# Altium schematic sheet CW308T_K24_UFO.SchDoc: <Enter Sheet Title>
size Letter; Organization: NewAE Technology Inc.; Address1: 1083 Queen St., Suite 196; Address2: Halifax; Address3: NS; Address4: Canada B3H 0B2; SheetApproved: NO
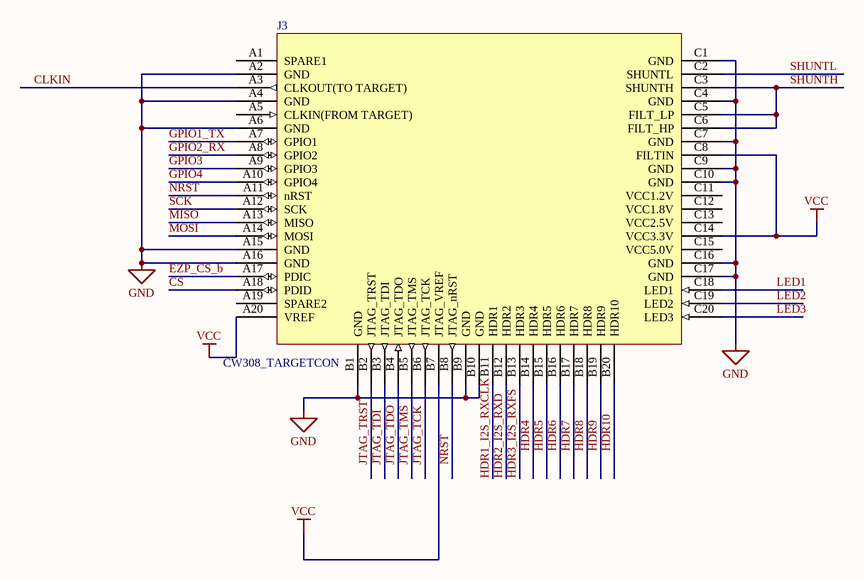
[diagram p0: CW308T_K24_UFO.SchDoc]

## Parts
J3  CW308_TARGETCON  [CW308_TBOARD_CONN]

## Nets
GND: J3.A2(GND) J3.A4(GND) J3.A6(GND) J3.A15(GND) J3.A16(GND) J3.B1(GND) J3.B9(GND) J3.B10(GND) J3.C1(GND) J3.C4(GND) J3.C7(GND) J3.C9(GND) J3.C10(GND) J3.C16(GND) J3.C17(GND)
VCC: J3.A20(VREF) J3.B7(JTAG_VREF) J3.C8(FILTIN) J3.C14(VCC3.3V)
CLKIN: J3.A3(CLKOUT(TO_TARGET))
CS: J3.A18(PDID)
EZP_CS_b: J3.A17(PDIC)
GPIO1_TX: J3.A7(GPIO1)
GPIO2_RX: J3.A8(GPIO2)
GPIO3: J3.A9(GPIO3)
GPIO4: J3.A10(GPIO4)
HDR1_I2S_RXCLK: J3.B11(HDR1)
HDR2_I2S_RXD: J3.B12(HDR2)
HDR3_I2S_RXFS: J3.B13(HDR3)
HDR4: J3.B14(HDR4)
HDR5: J3.B15(HDR5)
HDR6: J3.B16(HDR6)
HDR7: J3.B17(HDR7)
HDR8: J3.B18(HDR8)
HDR9: J3.B19(HDR9)
HDR10: J3.B20(HDR10)
JTAG_TCK: J3.B6(JTAG_TCK)
JTAG_TDI: J3.B3(JTAG_TDI)
JTAG_TDO: J3.B4(JTAG_TDO)
JTAG_TMS: J3.B5(JTAG_TMS)
JTAG_TRST: J3.B2(JTAG_TRST)
LED1: J3.C18(LED1)
LED2: J3.C19(LED2)
LED3: J3.C20(LED3)
MISO: J3.A13(MISO)
MOSI: J3.A14(MOSI)
NRST: J3.A11(nRST) J3.B8(JTAG_nRST)
SCK: J3.A12(SCK)
SHUNTH: J3.C3(SHUNTH) J3.C5(FILT_LP) J3.C6(FILT_HP)
SHUNTL: J3.C2(SHUNTL)

Not connected (* = marked no-connect by the designer): J3 A1(SPARE1) A5(CLKIN(FROM_TARGET)) A19(SPARE2) C11(VCC1.2V) C12(VCC1.8V) C13(VCC2.5V) C15(VCC5.0V)

## Notes on the sheet
- Title:
- Date:
- Rev:
- Time:
- Project:
- Sheet
- of
- License:
- Copyright © NewAE Technology Inc.
- Approved:
- NewAE.com
- File:

## Library data of the parts
J3 = CW308_TBOARD: CW308 "Standard" Target Board Connector; Component Group: Mechanical; Pitch: 2.54mm; Part Number: CW308_TBOARD; Pin Count: 60; Mounting Technology: Through-hole; Component Kind: Standard; Component Type: Standard